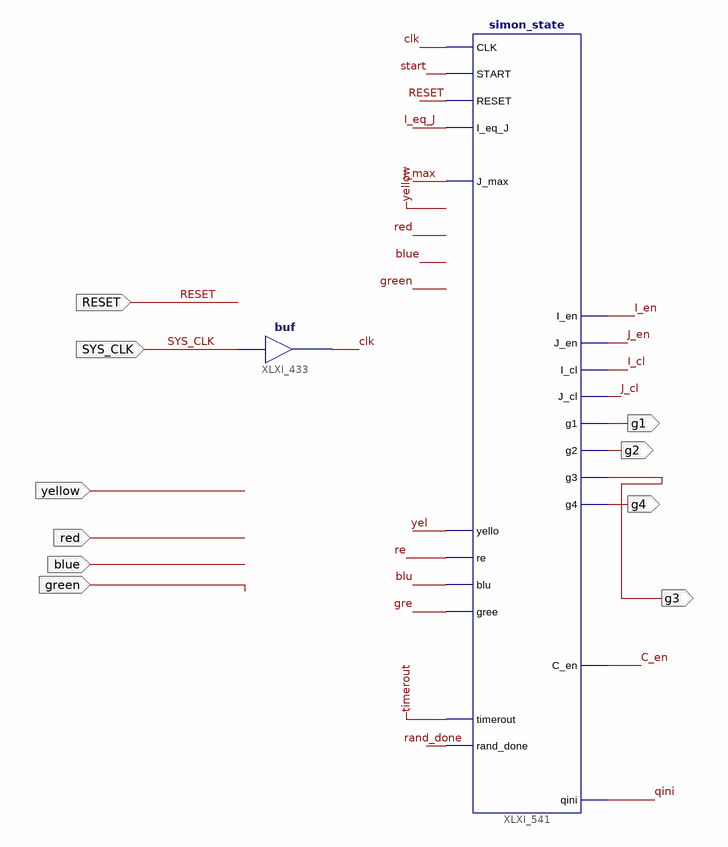
[diagram p0: schematic sheet 1]
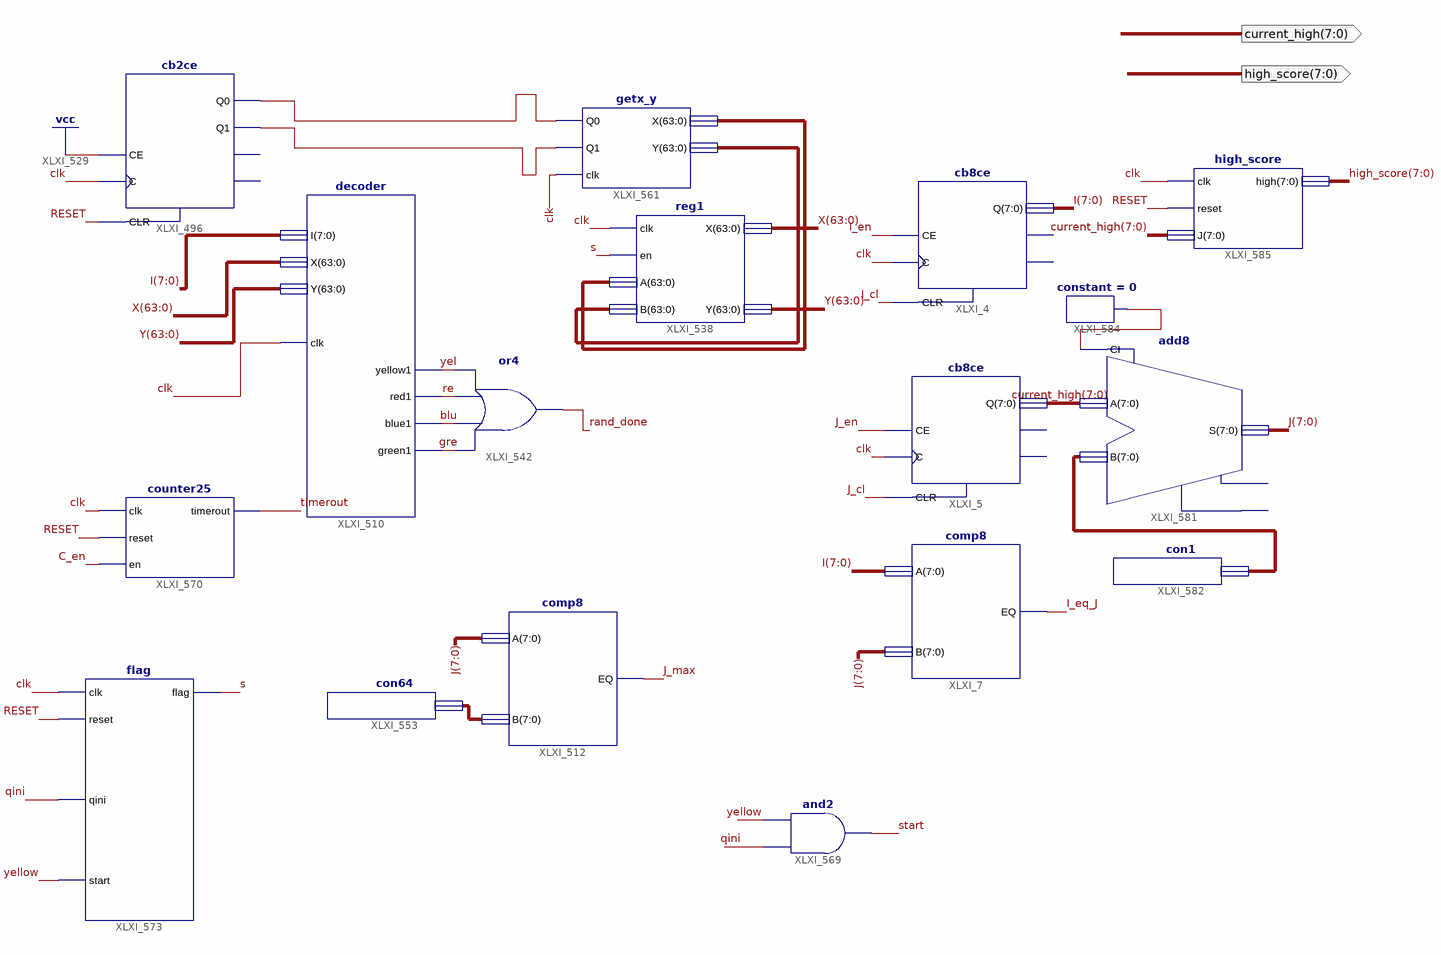
[diagram p1: schematic sheet 2]
// Xilinx ISE schematic simon_data_path.sch (spartan6) as structural Verilog: 19 symbols, 12 ports
module simon_data_path (
  input  RESET,
  input  SYS_CLK,
  input  yellow,
  input  red,
  input  blue,
  input  green,
  output g3,
  output g1,
  output g2,
  output g4,
  output [7:0] current_high,
  output [7:0] high_score
);

  wire blu, C_en, clk, gre, I_cl, I_en, I_eq_J, J_cl, J_en, J_max, qini, rand_done, re, s, start, timerout,
       XLXN_7, XLXN_8, XLXN_100, yel;
  wire [7:0] I, J, XLXN_72, XLXN_96;
  wire [63:0] X, XLXN_63, XLXN_64, Y;

  cb8ce XLXI_4 (.C(clk), .CE(I_en), .CLR(I_cl), .Q(I));  // open: CEO, TC
  cb8ce XLXI_5 (.C(clk), .CE(J_en), .CLR(J_cl), .Q(current_high));  // open: CEO, TC
  comp8 XLXI_7 (.A(I), .B(J), .EQ(I_eq_J));
  buf XLXI_433 (clk, SYS_CLK);
  cb2ce XLXI_496 (.C(clk), .CE(1'b1), .CLR(RESET), .Q0(XLXN_7), .Q1(XLXN_8));  // open: CEO, TC
  decoder XLXI_510 (.clk(clk), .I(I), .X(X), .Y(Y), .yellow1(yel), .red1(re), .blue1(blu), .green1(gre));
  comp8 XLXI_512 (.A(J), .B(XLXN_72), .EQ(J_max));
  reg1 XLXI_538 (.clk(clk), .en(s), .A(XLXN_63), .B(XLXN_64), .X(X), .Y(Y));
  simon_state XLXI_541 (
    .CLK(clk), .START(start), .RESET(RESET), .I_eq_J(I_eq_J), .timerout(timerout), .J_max(J_max),
    .yello(yel), .re(re), .blu(blu), .gree(gre), .Yellow(yellow), .Red(red), .Blue(blue), .Green(green),
    .rand_done(rand_done), .C_en(C_en), .I_en(I_en), .J_en(J_en), .I_cl(I_cl), .J_cl(J_cl), .g1(g1), .g2(g2),
    .g3(g3), .g4(g4), .qini(qini));
  or XLXI_542 (rand_done, gre, blu, re, yel);
  con64 XLXI_553 (.con(XLXN_72));
  getx_y XLXI_561 (.clk(clk), .Q0(XLXN_7), .Q1(XLXN_8), .X(XLXN_63), .Y(XLXN_64));
  and XLXI_569 (start, qini, yellow);
  counter25 XLXI_570 (.clk(clk), .reset(RESET), .en(C_en), .timerout(timerout));
  flag XLXI_573 (.reset(RESET), .clk(clk), .qini(qini), .start(yellow), .flag(s));
  add8 XLXI_581 (.A(current_high), .B(XLXN_96), .CI(XLXN_100), .S(J));  // open: CO, OFL
  con1 XLXI_582 (.con(XLXN_96));
  constant #(.CValue("0")) XLXI_584 (.O(XLXN_100));
  high_score XLXI_585 (.clk(clk), .reset(RESET), .J(current_high), .high(high_score));
endmodule
